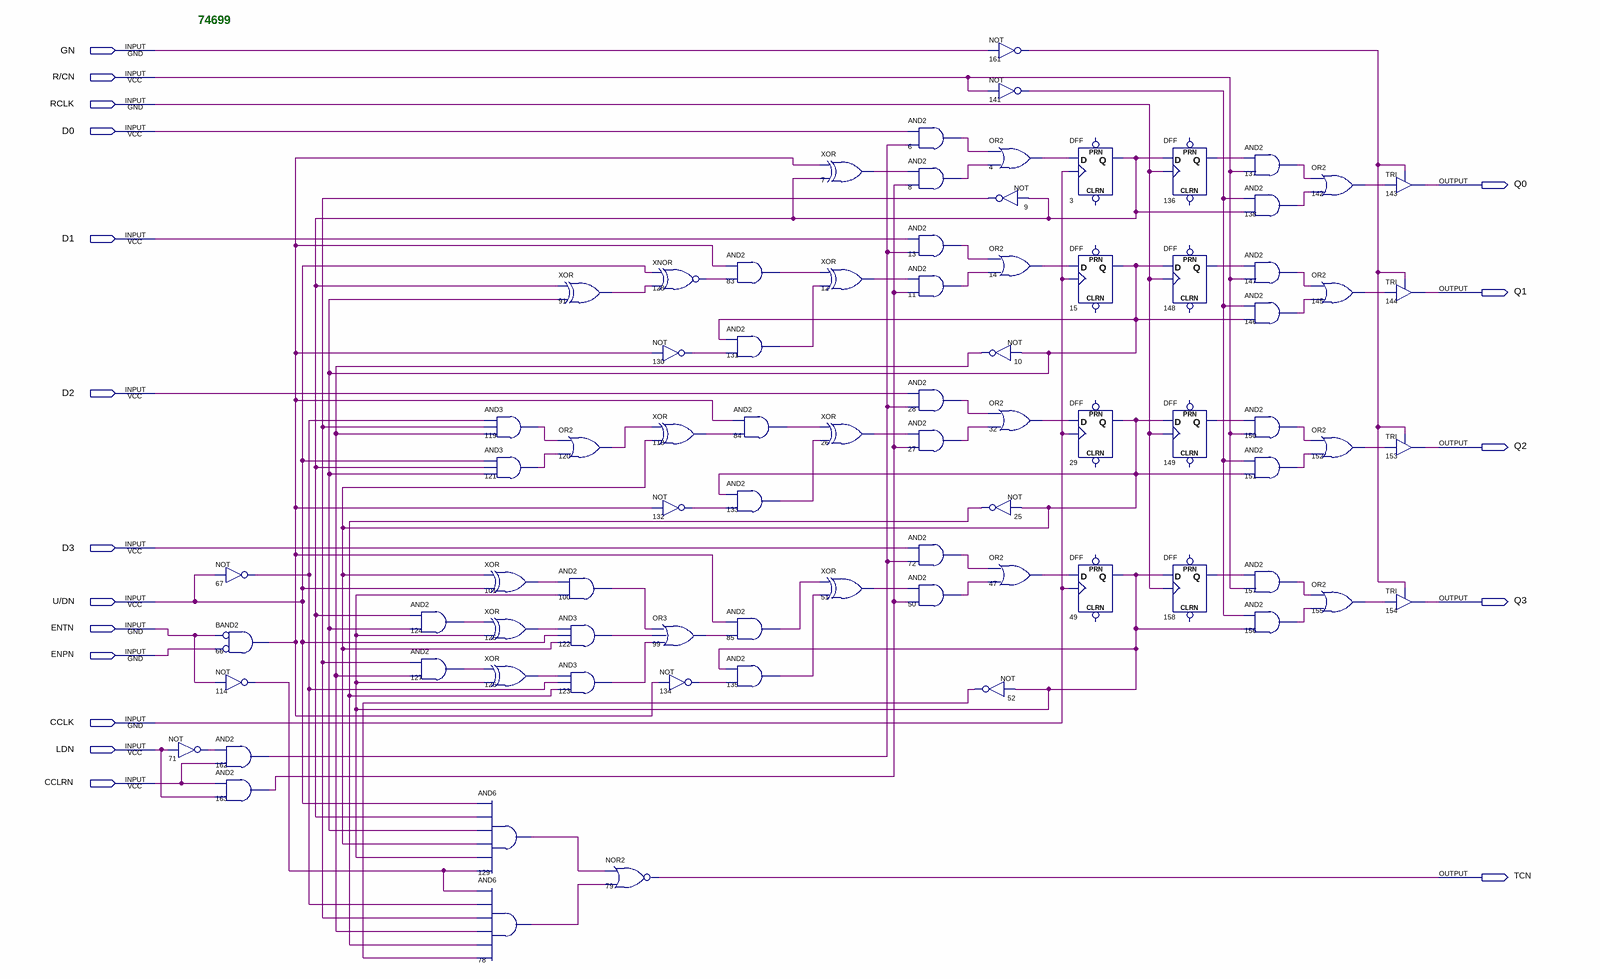
[diagram p0: schematic sheet]
// Quartus schematic 74699.bdf as structural Verilog: 79 symbols, 18 pins
module \74699  (
  input  GN,
  input  \R/CN ,
  input  RCLK,
  input  D0,
  input  D1,
  input  D2,
  input  D3,
  input  \U/DN ,
  input  ENTN,
  input  ENPN,
  input  CCLK,
  input  LDN,
  input  CCLRN,
  output Q0,
  output Q1,
  output Q2,
  output Q3,
  output TCN
);

  wire n3_q, n4_out, n6_out, n7_out, n8_out, n9_out, n10_out, n11_out, n12_out, n13_out, n14_out, n15_q,
       n25_out, n26_out, n27_out, n28_out, n29_q, n32_out, n47_out, n49_q, n50_out, n51_out, n52_out,
       n66_out, n67_out, n71_out, n72_out, n78_out, n83_out, n84_out, n85_out, n91_out, n99_out, n100_out,
       n101_out, n114_out, n118_out, n119_out, n120_out, n121_out, n122_out, n123_out, n124_out, n125_out,
       n126_out, n127_out, n128_out, n129_out, n130_out, n131_out, n132_out, n133_out, n134_out, n135_out,
       n136_q, n137_out, n138_out, n141_out, n142_out, n145_out, n146_out, n147_out, n148_q, n149_q,
       n150_out, n151_out, n152_out, n155_out, n156_out, n157_out, n158_q, n161_out, n162_out, n163_out;

  not u_67 (n67_out, \U/DN );
  and u_66 (n66_out, ~ENTN, ~ENPN);  // BAND2
  not u_114 (n114_out, ENTN);
  and u_162 (n162_out, n71_out, CCLRN);
  not u_71 (n71_out, LDN);
  and u_163 (n163_out, CCLRN, LDN);
  and u_124 (n124_out, n3_q, n15_q);
  and u_127 (n127_out, n9_out, n10_out);
  and u_119 (n119_out, n67_out, n9_out, n10_out);
  and u_121 (n121_out, \U/DN , n3_q, n15_q);
  xor u_101 (n101_out, n29_q, \U/DN );
  xor u_125 (n125_out, n124_out, n49_q);
  xor u_126 (n126_out, n127_out, n49_q);
  and u_129 (n129_out, \U/DN , n3_q, n15_q, n29_q, n49_q, n114_out);
  and u_78 (n78_out, n114_out, n67_out, n9_out, n10_out, n25_out, n52_out);
  xor u_91 (n91_out, n3_q, n15_q);
  or u_120 (n120_out, n119_out, n121_out);
  and u_100 (n100_out, n101_out, n49_q);
  and u_122 (n122_out, n125_out, \U/DN , n29_q);
  and u_123 (n123_out, n126_out, n67_out, n25_out);
  nor u_79 (TCN, n129_out, n78_out);
  xnor u_128 (n128_out, \U/DN , n91_out);
  not u_130 (n130_out, n66_out);
  xor u_118 (n118_out, n120_out, n29_q);
  not u_132 (n132_out, n66_out);
  or u_99 (n99_out, n100_out, n122_out, n123_out);
  not u_134 (n134_out, n66_out);
  and u_83 (n83_out, n66_out, n128_out);
  and u_131 (n131_out, n15_q, n130_out);
  and u_84 (n84_out, n66_out, n118_out);
  and u_133 (n133_out, n29_q, n132_out);
  and u_85 (n85_out, n66_out, n99_out);
  and u_135 (n135_out, n49_q, n134_out);
  xor u_7 (n7_out, n66_out, n3_q);
  xor u_12 (n12_out, n83_out, n131_out);
  xor u_26 (n26_out, n84_out, n133_out);
  xor u_51 (n51_out, n85_out, n135_out);
  and u_6 (n6_out, D0, n162_out);
  and u_8 (n8_out, n7_out, n163_out);
  and u_13 (n13_out, D1, n162_out);
  and u_11 (n11_out, n12_out, n163_out);
  and u_28 (n28_out, D2, n162_out);
  and u_27 (n27_out, n26_out, n163_out);
  and u_72 (n72_out, D3, n162_out);
  and u_50 (n50_out, n51_out, n163_out);
  not u_161 (n161_out, GN);
  not u_141 (n141_out, \R/CN );
  or u_4 (n4_out, n6_out, n8_out);
  not u_9 (n9_out, n3_q);
  or u_14 (n14_out, n13_out, n11_out);
  not u_10 (n10_out, n15_q);
  or u_32 (n32_out, n28_out, n27_out);
  not u_25 (n25_out, n29_q);
  or u_47 (n47_out, n72_out, n50_out);
  not u_52 (n52_out, n49_q);
  DFF u_3 (.CLK(CCLK), .D(n4_out), .Q(n3_q));  // open: CLRN, PRN
  DFF u_15 (.CLK(CCLK), .D(n14_out), .Q(n15_q));  // open: CLRN, PRN
  DFF u_29 (.CLK(CCLK), .D(n32_out), .Q(n29_q));  // open: CLRN, PRN
  DFF u_49 (.CLK(CCLK), .D(n47_out), .Q(n49_q));  // open: CLRN, PRN
  DFF u_136 (.CLK(RCLK), .D(n3_q), .Q(n136_q));  // open: CLRN, PRN
  DFF u_148 (.CLK(RCLK), .D(n15_q), .Q(n148_q));  // open: CLRN, PRN
  DFF u_149 (.CLK(RCLK), .D(n29_q), .Q(n149_q));  // open: CLRN, PRN
  DFF u_158 (.CLK(RCLK), .D(n49_q), .Q(n158_q));  // open: CLRN, PRN
  and u_137 (n137_out, n136_q, \R/CN );
  and u_138 (n138_out, n141_out, n3_q);
  and u_147 (n147_out, n148_q, \R/CN );
  and u_146 (n146_out, n141_out, n15_q);
  and u_150 (n150_out, n149_q, \R/CN );
  and u_151 (n151_out, n141_out, n29_q);
  and u_157 (n157_out, n158_q, \R/CN );
  and u_156 (n156_out, n141_out, n49_q);
  or u_142 (n142_out, n137_out, n138_out);
  or u_145 (n145_out, n147_out, n146_out);
  or u_152 (n152_out, n150_out, n151_out);
  or u_155 (n155_out, n157_out, n156_out);
  TRI u_143 (.IN(n142_out), .OE(n161_out), .OUT(Q0));
  TRI u_144 (.IN(n145_out), .OE(n161_out), .OUT(Q1));
  TRI u_153 (.IN(n152_out), .OE(n161_out), .OUT(Q2));
  TRI u_154 (.IN(n155_out), .OE(n161_out), .OUT(Q3));

  // Notes on the sheet:
  //   74699
endmodule
